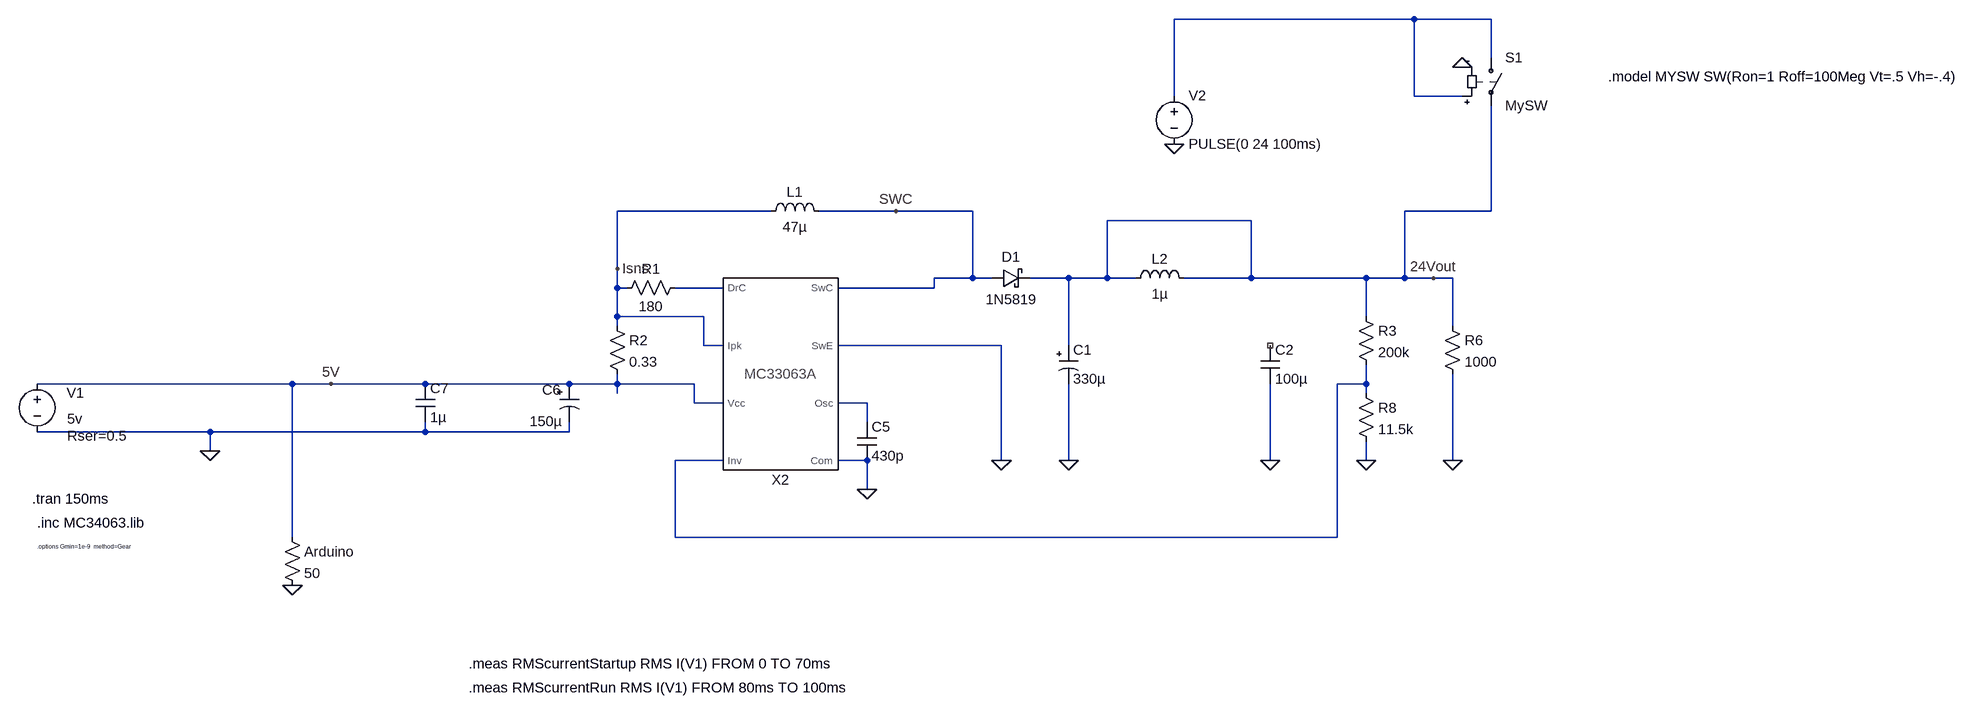
[diagram p0: schematic BoostConverter.asc]
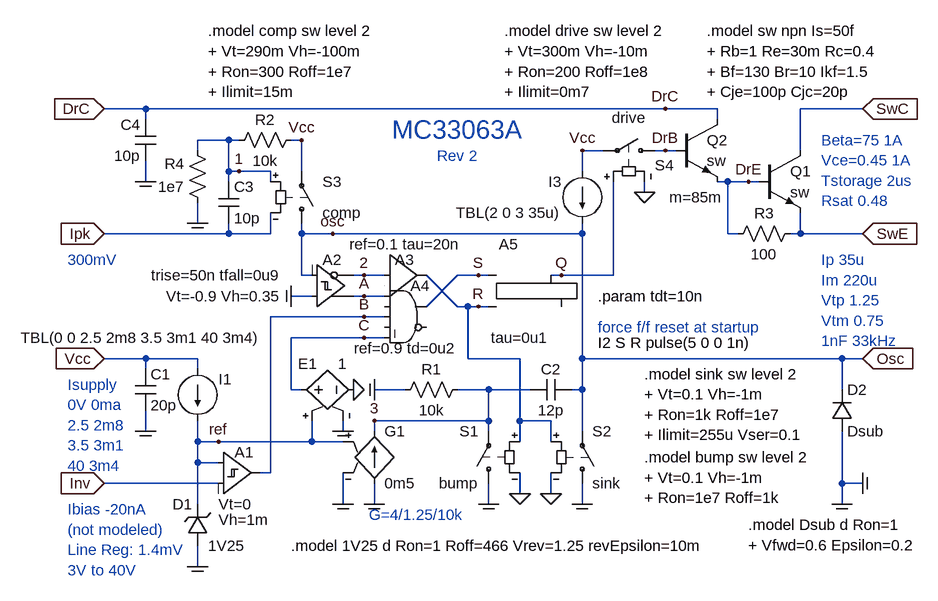
[diagram p1: sub-circuit mc33063a.asc]
BoostConverter.asc, the LTspice schematic file:
Version 4
SHEET 1 2464 680
WIRE 1440 -576 1040 -576
WIRE 1568 -576 1440 -576
WIRE 1568 -512 1568 -576
WIRE 1040 -448 1040 -576
WIRE 1440 -448 1440 -576
WIRE 1520 -448 1440 -448
WIRE 368 -256 112 -256
WIRE 576 -256 448 -256
WIRE 704 -256 576 -256
WIRE 1568 -256 1568 -432
WIRE 1568 -256 1424 -256
WIRE 1168 -240 928 -240
WIRE 112 -160 112 -256
WIRE 704 -144 704 -256
WIRE 704 -144 640 -144
WIRE 736 -144 704 -144
WIRE 864 -144 800 -144
WIRE 928 -144 928 -240
WIRE 928 -144 864 -144
WIRE 976 -144 928 -144
WIRE 1168 -144 1168 -240
WIRE 1168 -144 1056 -144
WIRE 1360 -144 1168 -144
WIRE 1424 -144 1424 -256
WIRE 1424 -144 1360 -144
WIRE 1472 -144 1424 -144
WIRE 1504 -144 1472 -144
WIRE 112 -128 112 -160
WIRE 128 -128 112 -128
WIRE 288 -128 208 -128
WIRE 640 -128 640 -144
WIRE 640 -128 480 -128
WIRE 112 -80 112 -128
WIRE 256 -80 112 -80
WIRE 1360 -80 1360 -144
WIRE 112 -64 112 -80
WIRE 1504 -64 1504 -144
WIRE 256 -32 256 -80
WIRE 288 -32 256 -32
WIRE 752 -32 480 -32
WIRE 864 -32 864 -144
WIRE -448 32 -880 32
WIRE -384 32 -448 32
WIRE -208 32 -384 32
WIRE 32 32 -208 32
WIRE 112 32 112 16
WIRE 112 32 32 32
WIRE 240 32 112 32
WIRE 1360 32 1360 0
WIRE 1360 32 1312 32
WIRE 112 48 112 32
WIRE 1360 48 1360 32
WIRE 240 64 240 32
WIRE 288 64 240 64
WIRE 528 64 480 64
WIRE 528 96 528 64
WIRE -592 112 -880 112
WIRE -208 112 -208 96
WIRE -208 112 -592 112
WIRE 32 112 32 96
WIRE 32 112 -208 112
WIRE -592 144 -592 112
WIRE 288 160 208 160
WIRE 528 160 480 160
WIRE 752 160 752 -32
WIRE 864 160 864 32
WIRE 1200 160 1200 32
WIRE 1360 160 1360 128
WIRE 1504 160 1504 16
WIRE 528 208 528 160
WIRE -448 288 -448 32
WIRE 208 288 208 160
WIRE 1312 288 1312 32
WIRE 1312 288 208 288
FLAG -592 144 0
FLAG 864 160 0
FLAG 1504 160 0
FLAG 752 160 0
FLAG 1472 -144 24Vout
FLAG 1200 160 0
FLAG -448 368 0
FLAG 528 208 0
FLAG 1360 160 0
FLAG -384 32 5V
FLAG 112 -160 Isns
FLAG 576 -256 SWC
FLAG 1040 -368 0
FLAG 1520 -496 0
SYMBOL voltage -880 16 R0
WINDOW 0 49 31 Left 2
WINDOW 3 50 75 Left 2
WINDOW 123 0 0 Left 2
WINDOW 39 50 103 Left 2
SYMATTR InstName V1
SYMATTR Value 5v
SYMATTR SpiceLine Rser=0.5
SYMBOL res 224 -144 R90
WINDOW 0 0 56 VBottom 2
WINDOW 3 32 56 VTop 2
SYMATTR InstName R1
SYMATTR Value 180
SYMBOL res 96 -80 R0
SYMATTR InstName R2
SYMATTR Value 0.33
SYMBOL schottky 736 -128 R270
WINDOW 0 36 32 VTop 2
WINDOW 3 -4 32 VBottom 2
SYMATTR InstName D1
SYMATTR Value 1N5819
SYMATTR Description Zener Diode
SYMATTR Type zener
SYMBOL polcap 848 -32 R0
WINDOW 3 24 56 Left 2
SYMATTR Value 330µ
SYMATTR InstName C1
SYMATTR SpiceLine V=2.5 Irms=3 Rser=0.006 Lser=0 mfg="Rubycon" pn="2.5SWZ330M R09" type="Al electrolytic"
SYMATTR Description Capacitor
SYMATTR Type cap
SYMBOL ind 352 -240 R270
WINDOW 0 32 56 VTop 2
WINDOW 3 5 56 VBottom 2
SYMATTR InstName L1
SYMATTR Value 47µ
SYMATTR SpiceLine Ipk=0.85 Rser=0.123 Rpar=32930 Cpar=2.612p mfg="Bourns, Inc." pn="SRR6040A-470M"
SYMBOL res 1488 -80 R0
SYMATTR InstName R6
SYMATTR Value 1000
SYMBOL ind 960 -128 R270
WINDOW 0 32 56 VTop 2
WINDOW 3 5 56 VBottom 2
SYMATTR InstName L2
SYMATTR Value 1µ
SYMBOL cap 1184 -32 R0
SYMATTR InstName C2
SYMATTR Value 100µ
SYMBOL polcap 16 32 R0
WINDOW 0 -29 10 Left 2
WINDOW 3 -50 63 Left 2
SYMATTR InstName C6
SYMATTR Value 150µ
SYMATTR Description Capacitor
SYMATTR Type cap
SYMATTR SpiceLine V=2 Irms=3.87298 Rser=0.018 Lser=0 mfg="KEMET" pn="A700V157M002ATE018" type="Al electrolytic"
SYMBOL res -464 272 R0
SYMATTR InstName Arduino
SYMATTR Value 50
SYMBOL cap 512 96 R0
SYMATTR InstName C5
SYMATTR Value 430p
SYMBOL res 1344 -96 R0
SYMATTR InstName R3
SYMATTR Value 200k
SYMBOL res 1344 32 R0
SYMATTR InstName R8
SYMATTR Value 11.5k
SYMBOL MC33063A 384 16 M0
WINDOW 0 0 176 Center 2
SYMATTR InstName X2
SYMBOL cap -224 32 R0
SYMATTR InstName C7
SYMATTR Value 1µ
SYMATTR SpiceLine V=50 Irms=0 Rser=0.005952 Lser=569.87f
SYMBOL voltage 1040 -464 R0
WINDOW 123 0 0 Left 2
WINDOW 39 0 0 Left 2
SYMATTR InstName V2
SYMATTR Value PULSE(0 24 100ms)
SYMBOL sw 1568 -528 R0
SYMATTR InstName S1
SYMATTR Value MySW
TEXT -888 224 Left 2 !.tran 150ms
TEXT -880 264 Left 2 !.inc MC34063.lib
TEXT -880 304 Left 0 !.options Gmin=1e-9  method=Gear
TEXT -136 504 Left 2 !.meas RMScurrentStartup RMS I(V1) FROM 0 TO 70ms
TEXT -136 544 Left 2 !.meas RMScurrentRun RMS I(V1) FROM 80ms TO 100ms
TEXT 1832 -480 Left 2 !.model MYSW SW(Ron=1 Roff=100Meg Vt=.5 Vh=-.4)

mc33063a.asc, the sub-circuit schematic file:
Version 4
SHEET 1 1352 1072
WIRE -608 -64 -672 -64
WIRE 192 -64 -608 -64
WIRE 272 -64 192 -64
WIRE 496 -64 400 -64
WIRE -608 -48 -608 -64
WIRE 272 -48 272 -64
WIRE -480 -16 -528 -16
WIRE -464 -16 -480 -16
WIRE -368 -16 -384 -16
WIRE -528 0 -528 -16
WIRE 96 0 64 0
WIRE 192 0 176 0
WIRE 208 0 192 0
WIRE 400 0 400 -64
WIRE -480 32 -480 -16
WIRE -464 32 -480 32
WIRE -416 32 -464 32
WIRE -368 32 -368 -16
WIRE 64 32 64 0
WIRE -608 48 -608 16
WIRE -480 48 -480 32
WIRE -416 48 -416 32
WIRE 288 48 272 48
WIRE 320 48 288 48
WIRE 336 48 320 48
WIRE 160 64 160 48
WIRE -528 112 -528 80
WIRE -480 128 -480 112
WIRE -480 128 -672 128
WIRE -416 128 -416 96
WIRE -416 128 -480 128
WIRE -368 128 -368 112
WIRE -320 128 -368 128
WIRE 64 128 64 112
WIRE 64 128 -320 128
WIRE 288 128 288 48
WIRE 304 128 288 128
WIRE 400 128 400 96
WIRE 400 128 384 128
WIRE 496 128 400 128
WIRE -368 192 -368 128
WIRE -352 192 -368 192
WIRE -272 192 -288 192
WIRE -240 192 -272 192
WIRE -96 192 -128 192
WIRE -80 192 -96 192
WIRE 32 192 16 192
WIRE 112 192 112 48
WIRE 112 192 32 192
WIRE -352 224 -384 224
WIRE -272 224 -288 224
WIRE -240 224 -272 224
WIRE -176 240 -128 192
WIRE -128 240 -176 192
WIRE -112 240 -128 240
WIRE -96 240 -112 240
WIRE -80 240 -96 240
WIRE -272 256 -416 256
WIRE -240 256 -272 256
WIRE -272 288 -384 288
WIRE -240 288 -272 288
WIRE -608 320 -672 320
WIRE -528 320 -608 320
WIRE -112 320 -112 240
WIRE -32 320 -112 320
WIRE 64 320 64 128
WIRE 464 320 64 320
WIRE 496 320 464 320
WIRE -608 336 -608 320
WIRE -528 336 -528 320
WIRE -384 368 -384 288
WIRE -368 368 -384 368
WIRE -208 368 -256 368
WIRE -80 368 -128 368
WIRE -16 368 -80 368
WIRE 64 368 64 320
WIRE 64 368 48 368
WIRE 464 368 464 320
WIRE -80 416 -80 368
WIRE -80 416 -256 416
WIRE -32 416 -32 320
WIRE 16 416 -32 416
WIRE -608 432 -608 400
WIRE -304 432 -304 416
WIRE -256 432 -256 416
WIRE -80 432 -80 416
WIRE 64 432 64 368
WIRE -528 448 -528 416
WIRE -496 448 -528 448
WIRE -352 448 -352 416
WIRE -352 448 -496 448
WIRE -304 448 -352 448
WIRE -32 448 -32 416
WIRE 16 448 16 416
WIRE -528 480 -528 448
WIRE -496 480 -528 480
WIRE -416 496 -416 256
WIRE -416 496 -432 496
WIRE -496 512 -672 512
WIRE 464 512 464 432
WIRE 496 512 464 512
WIRE -32 528 -32 496
WIRE 16 528 16 496
WIRE -528 544 -528 480
WIRE -304 544 -304 496
WIRE -256 544 -256 512
WIRE -80 544 -80 512
WIRE 64 544 64 512
WIRE 464 544 464 512
WIRE -528 640 -528 608
FLAG -672 -64 DrC
IOPIN -672 -64 In
FLAG -672 128 Ipk
IOPIN -672 128 In
FLAG -672 320 Vcc
IOPIN -672 320 In
FLAG -672 512 Inv
IOPIN -672 512 In
FLAG 496 -64 SwC
IOPIN 496 -64 In
FLAG 496 128 SwE
IOPIN 496 128 In
FLAG 496 320 Osc
IOPIN 496 320 In
FLAG 496 512 Com
IOPIN 496 512 In
FLAG 464 544 COM
FLAG -528 640 COM
FLAG 64 0 Vcc
FLAG 64 544 COM
FLAG -368 -16 Vcc
FLAG 160 64 0
FLAG -464 32 1
FLAG -272 224 A
FLAG -272 256 B
FLAG -96 192 S
FLAG -96 240 R
FLAG 32 192 Q
FLAG 320 48 DrE
FLAG -272 192 2
FLAG -608 48 COM
FLAG -384 224 COM
FLAG -608 432 COM
FLAG 16 528 0
FLAG -32 528 0
FLAG -80 544 COM
FLAG -256 544 COM
FLAG -256 368 COM
FLAG -304 544 COM
FLAG -496 448 ref
FLAG -256 416 3
FLAG -320 128 osc
FLAG -272 288 C
FLAG 192 -64 DrC
FLAG -528 112 COM
FLAG 192 0 DrB
FLAG -288 368 0
FLAG -304 432 COM
SYMBOL cap -624 336 R0
SYMATTR InstName C1
SYMATTR Value 20p
SYMBOL current -528 336 M0
WINDOW 123 0 0 Left 2
WINDOW 39 0 0 Left 2
WINDOW 3 -99 -48 Left 2
WINDOW 0 -32 16 Right 2
SYMATTR Value TBL(0 0 2.5 2m8 3.5 3m1 40 3m4)
SYMATTR InstName I1
SYMBOL zener -512 608 R180
WINDOW 0 24 64 Left 2
WINDOW 3 0 0 Right 2
SYMATTR InstName D1
SYMATTR Value 1V25
SYMBOL Digital\\diffschmtbuf -496 432 R0
WINDOW 3 0 112 Left 2
WINDOW 0 25 32 Left 2
WINDOW 123 0 136 Left 2
SYMATTR Value Vt=0
SYMATTR InstName A1
SYMATTR Value2 Vh=1m
SYMATTR SpiceLine tripdt={tdt}
SYMBOL Digital\\diffschmitt -352 272 M180
WINDOW 3 -48 48 Right 2
WINDOW 0 16 104 Left 2
WINDOW 123 -48 80 Right 2
SYMATTR Value Vt=-0.9 Vh=0.35
SYMATTR InstName A2
SYMATTR Value2 trise=50n tfall=0u9
SYMATTR SpiceLine tripdt={tdt}
SYMBOL Digital\\buf1 -240 128 R0
WINDOW 0 16 40 Left 2
WINDOW 3 32 16 Center 2
SYMATTR InstName A3
SYMATTR Value ref=0.1 tau=20n
SYMATTR Value2 tripdt={tdt}
SYMBOL Digital\\and -208 192 R0
WINDOW 3 0 112 Center 2
SYMATTR Value ref=0.9 td=0u2
SYMATTR InstName A4
SYMATTR Value2 tripdt={tdt}
SYMBOL Digital\\srflop -32 144 R0
WINDOW 3 0 144 Center 2
WINDOW 0 -32 0 Left 2
SYMATTR Value tau=0u1
SYMATTR InstName A5
SYMATTR Value2 tripdt={tdt}
SYMBOL g -256 416 R0
WINDOW 0 16 16 Left 2
WINDOW 3 16 96 Left 2
SYMATTR InstName G1
SYMATTR Value 0m5
SYMBOL res -224 384 R270
WINDOW 0 32 56 VTop 2
WINDOW 3 0 56 VBottom 2
SYMATTR InstName R1
SYMATTR Value 10k
SYMBOL cap 48 352 R90
WINDOW 0 0 32 VBottom 2
WINDOW 3 32 32 VTop 2
SYMATTR InstName C2
SYMATTR Value 12p
SYMBOL sw -80 528 R180
WINDOW 0 16 96 Left 2
WINDOW 3 16 16 Left 2
SYMATTR InstName S1
SYMATTR Value bump
SYMBOL sw 64 528 M180
WINDOW 0 16 96 Left 2
WINDOW 3 16 16 Left 2
SYMATTR InstName S2
SYMATTR Value sink
SYMBOL current 64 32 M0
WINDOW 0 32 16 Left 2
WINDOW 3 32 64 Left 2
SYMATTR InstName I3
SYMATTR Value TBL(2 0 3 35u)
SYMBOL res -480 0 R270
WINDOW 0 32 56 VTop 2
WINDOW 3 0 56 VBottom 2
SYMATTR InstName R2
SYMATTR Value 10k
SYMBOL cap -496 48 R0
SYMATTR InstName C3
SYMATTR Value 10p
SYMBOL sw -368 128 M180
WINDOW 0 32 80 Left 2
WINDOW 3 32 32 Left 2
SYMATTR InstName S3
SYMATTR Value comp
SYMBOL cap -592 -48 M0
SYMATTR InstName C4
SYMATTR Value 10p
SYMBOL sw 192 0 M270
WINDOW 0 -23 16 VLeft 2
WINDOW 3 35 56 VTop 2
SYMATTR InstName S4
SYMATTR Value drive
SYMBOL res 288 144 R270
WINDOW 0 32 56 VTop 2
WINDOW 3 0 56 VBottom 2
SYMATTR InstName R3
SYMATTR Value 100
SYMBOL npn 336 0 R0
WINDOW 0 48 32 Left 2
WINDOW 3 48 64 Left 2
SYMATTR InstName Q1
SYMATTR Value sw
SYMBOL diode 448 432 M180
WINDOW 0 24 64 Left 2
WINDOW 3 24 0 Left 2
SYMATTR InstName D2
SYMATTR Value Dsub
SYMBOL res -512 96 R180
WINDOW 0 36 76 Left 2
WINDOW 3 36 40 Left 2
SYMATTR InstName R4
SYMATTR Value 1e7
SYMBOL npn 208 -48 R0
WINDOW 0 48 32 Left 2
WINDOW 3 48 64 Left 2
WINDOW 123 72 120 Right 2
SYMATTR InstName Q2
SYMATTR Value sw
SYMATTR Value2 m=85m
SYMBOL e -384 368 R270
WINDOW 0 40 40 VLeft 2
WINDOW 3 40 72 VRight 2
SYMATTR InstName E1
SYMATTR Value 1
TEXT -512 -184 Left 2 !.model comp sw level 2\n+ Vt=290m Vh=-100m\n+ Ron=300 Roff=1e7\n+ Ilimit=15m
TEXT 160 344 Left 2 !.model sink sw level 2\n+ Vt=0.1 Vh=-1m\n+ Ron=1k Roff=1e7\n+ Ilimit=255u Vser=0.1
TEXT 160 472 Left 2 !.model bump sw level 2\n+ Vt=0.1 Vh=-1m\n+ Ron=1e7 Roff=1k
TEXT -384 608 Left 2 !.model 1V25 d Ron=1 Roff=466 Vrev=1.25 revEpsilon=10m
TEXT -128 -32 Center 4 ;MC33063A
TEXT -728 168 Left 2 ;300mV
TEXT -728 360 Left 2 ;Isupply\n0V 0ma\n2.5 2m8\n3.5 3m1\n40 3m4
TEXT -728 552 Left 2 ;Ibias -20nA\n(not modeled)\nLine Reg: 1.4mV\n3V to 40V
TEXT 432 -16 Left 2 ;Beta=75 1A\nVce=0.45 1A\nTstorage 2us\nRsat 0.48
TEXT 432 168 Left 2 ;Ip 35u\nIm 220u\nVtp 1.25\nVtm 0.75\n1nF 33kHz
TEXT 88 224 Left 2 !.param tdt=10n
TEXT 88 296 Left 2 !I2 S R pulse(5 0 0 1n)
TEXT -264 560 Left 2 ;G=4/1.25/10k
TEXT 88 272 Left 2 ;force f/f reset at startup
TEXT 320 576 Left 2 !.model Dsub d Ron=1\n+ Vfwd=0.6 Epsilon=0.2
TEXT 256 -184 Left 2 !.model sw npn Is=50f\n+ Rb=1 Re=30m Rc=0.4\n+ Bf=130 Br=10 Ikf=1.5\n+ Cje=100p Cjc=20p
TEXT -56 -184 Left 2 !.model drive sw level 2\n+ Vt=300m Vh=-10m\n+ Ron=200 Roff=1e8\n+ Ilimit=0m7
TEXT -128 8 Center 2 ;Rev 2

The netlist it stands for:
* BoostConverter.asc
V1 5V 0 5v Rser=0.5
R1 N002 Isns 180
R2 Isns 5V 0.33
D1 SWC 24Vout 1N5819
C1 24Vout 0 330µ V=2.5 Irms=3 Rser=0.006 Lser=0 mfg="Rubycon" pn="2.5SWZ330M R09" type="Al electrolytic"
L1 Isns SWC 47µ Ipk=0.85 Rser=0.123 Rpar=32930 Cpar=2.612p mfg="Bourns, Inc." pn="SRR6040A-470M"
R6 24Vout 0 1000
L2 24Vout 24Vout 1µ
C2 NC_01 0 100µ
C6 5V 0 150µ V=2 Irms=3.87298 Rser=0.018 Lser=0 mfg="KEMET" pn="A700V157M002ATE018" type="Al electrolytic"
R§Arduino 5V 0 50
C5 N004 0 430p
R3 24Vout N003 200k
R8 N003 0 11.5k
XX2 SWC 0 N004 0 N003 5V Isns N002 mc33063a
C7 5V 0 1µ V=50 Irms=0 Rser=0.005952 Lser=569.87f
V2 N001 0 PULSE(0 24 100ms)
S1 N001 24Vout N001 0 MySW

* block symbol definitions
.subckt mc33063a SwC SwE Osc Com Inv Vcc Ipk DrC
C1 Vcc Com 20p
I1 Vcc ref TBL(0 0 2.5 2m8 3.5 3m1 40 3m4)
D1 Com ref 1V25
A1 ref Inv 0 0 0 0 B 0 SCHMITT Vt=0 Vh=1m tripdt={tdt}
A2 Com Osc 0 0 0 2 A 0 SCHMITT Vt=-0.9 Vh=0.35 trise=50n tfall=0u9 tripdt={tdt}
A3 2 0 0 0 0 0 R 0 BUF ref=0.1 tau=20n tripdt={tdt}
A4 A 0 B 0 C 0 S 0 AND ref=0.9 td=0u2 tripdt={tdt}
A5 S R 0 0 0 0 Q 0 SRFLOP tau=0u1 tripdt={tdt}
G1 Com 3 ref Com 0m5
R1 Com 3 10k
C2 Osc 3 12p
S1 Com 3 R 0 bump
S2 Com Osc R 0 sink
I3 Vcc Osc TBL(2 0 3 35u)
R2 1 Vcc 10k
C3 1 Ipk 10p
S3 Osc Vcc 1 Ipk comp
C4 DrC Com 10p
S4 DrB Vcc Q 0 drive
R3 DrE SwE 100
Q1 SwC DrE SwE 0 sw
D2 Com Osc Dsub
R4 Com 1 1e7
Q2 DrC DrB DrE 0 sw m=85m
E1 C 0 ref Com 1
.model comp sw level 2
+ Vt=290m Vh=-100m
+ Ron=300 Roff=1e7
+ Ilimit=15m
.model sink sw level 2
+ Vt=0.1 Vh=-1m
+ Ron=1k Roff=1e7
+ Ilimit=255u Vser=0.1
.model bump sw level 2
+ Vt=0.1 Vh=-1m
+ Ron=1e7 Roff=1k
.model 1V25 d Ron=1 Roff=466 Vrev=1.25 revEpsilon=10m
* MC33063A
* 300mV
* Isupply
* 0V 0ma
* 2.5 2m8
* 3.5 3m1
* 40 3m4
* Ibias -20nA
* (not modeled)
* Line Reg: 1.4mV
* 3V to 40V
* Beta=75 1A
* Vce=0.45 1A
* Tstorage 2us
* Rsat 0.48
* Ip 35u
* Im 220u
* Vtp 1.25
* Vtm 0.75
* 1nF 33kHz
.param tdt=10n
I2 S R pulse(5 0 0 1n)
* G=4/1.25/10k
* force f/f reset at startup
.model Dsub d Ron=1
+ Vfwd=0.6 Epsilon=0.2
.model sw npn Is=50f
+ Rb=1 Re=30m Rc=0.4
+ Bf=130 Br=10 Ikf=1.5
+ Cje=100p Cjc=20p
.model drive sw level 2
+ Vt=300m Vh=-10m
+ Ron=200 Roff=1e8
+ Ilimit=0m7
* Rev 2
.ends mc33063a

.model D D
.lib standard.dio
.model NPN NPN
.model PNP PNP
.lib standard.bjt
.tran 150ms
.inc MC34063.lib
.options Gmin=1e-9  method=Gear
.meas RMScurrentStartup RMS I(V1) FROM 0 TO 70ms
.meas RMScurrentRun RMS I(V1) FROM 80ms TO 100ms
.model MYSW SW(Ron=1 Roff=100Meg Vt=.5 Vh=-.4)
.backanno
.end